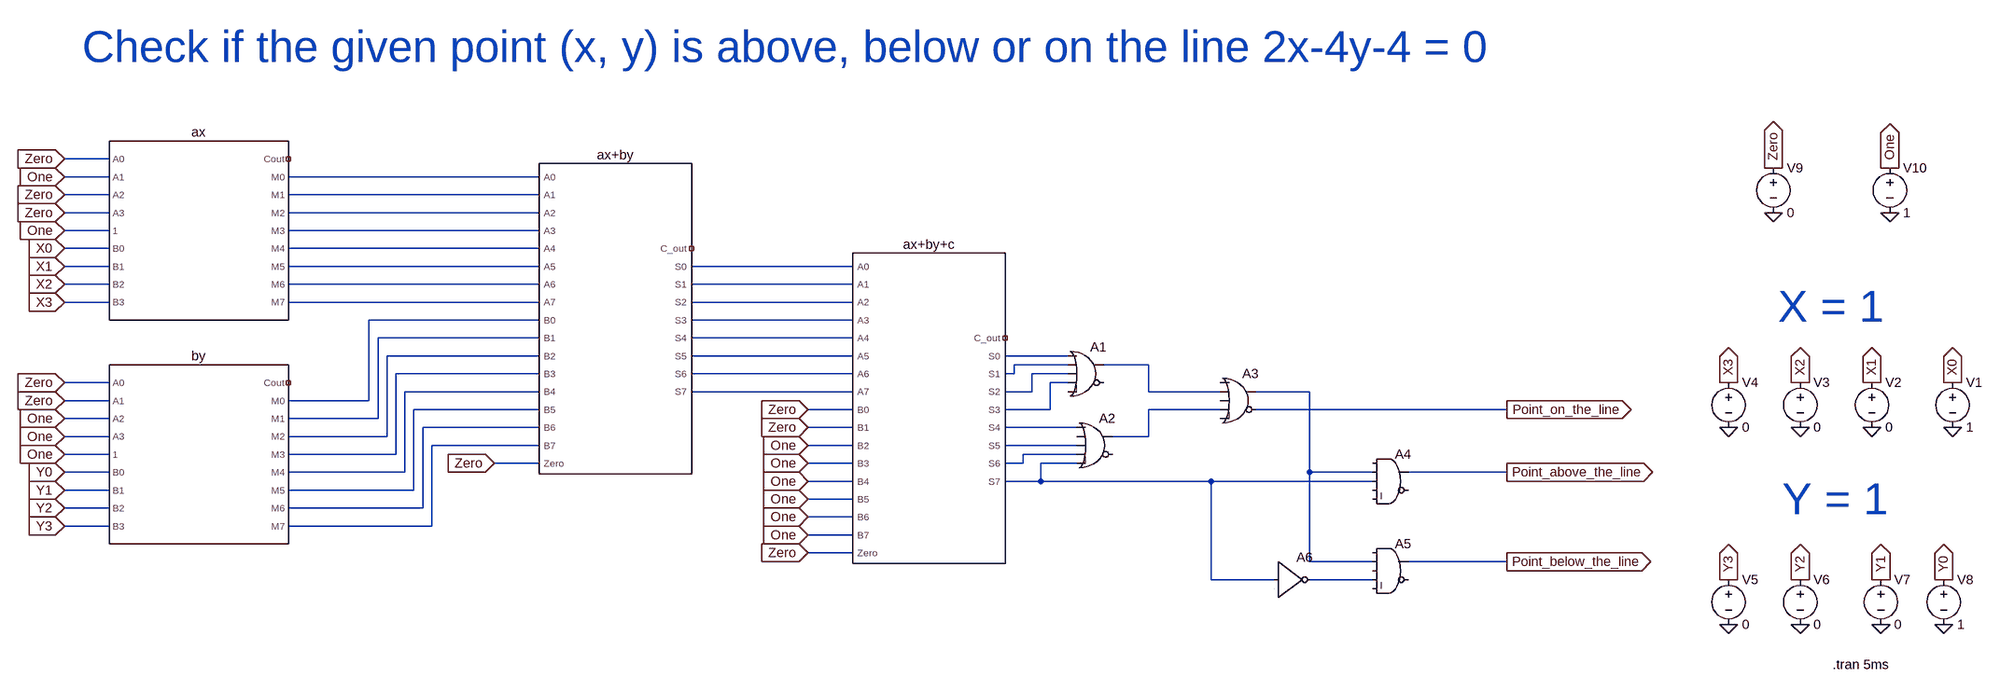
[diagram p0: schematic P3_above_the_line.asc]
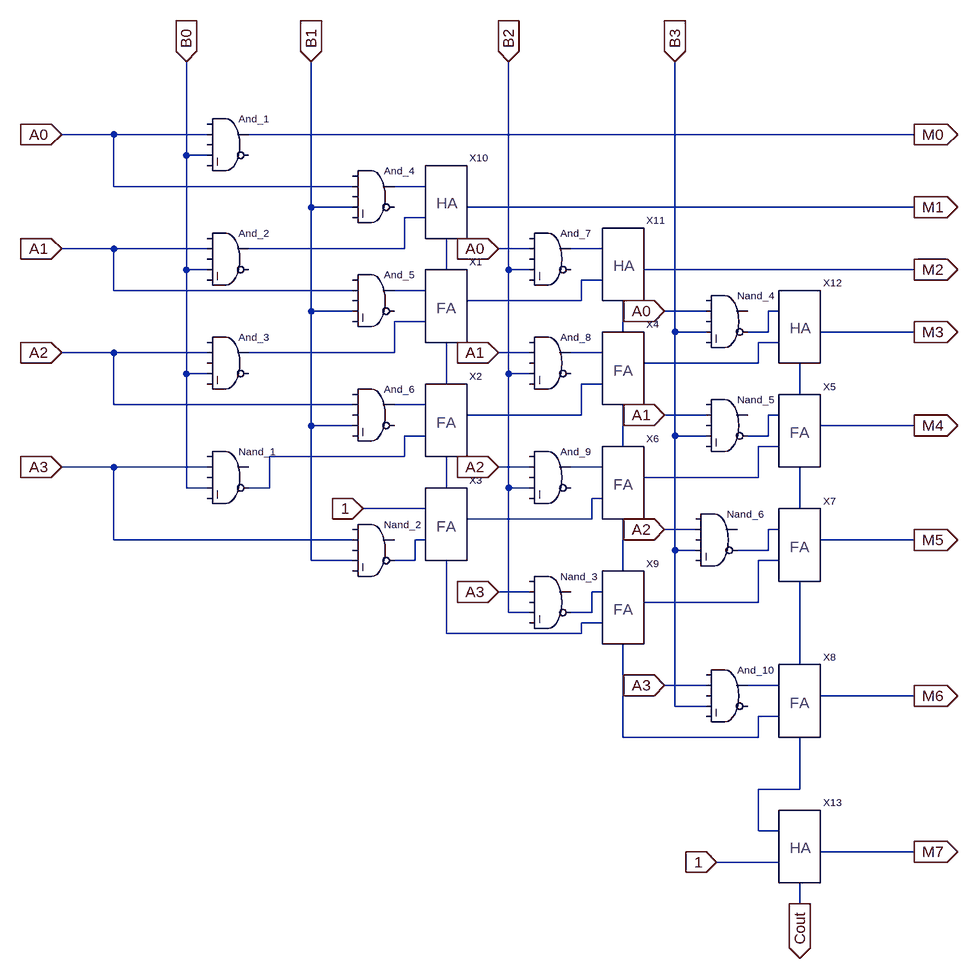
[diagram p1: sub-circuit bough_wooley_multiplier.asc]
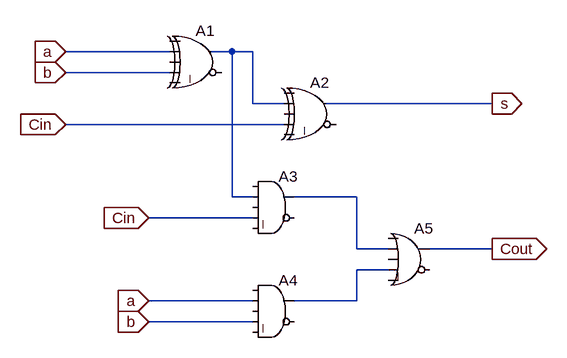
[diagram p2: sub-circuit full_adder_vertical.asc]
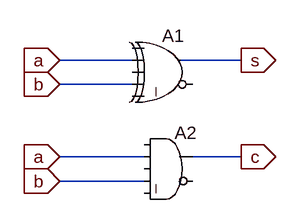
[diagram p3: sub-circuit half_adder.asc]
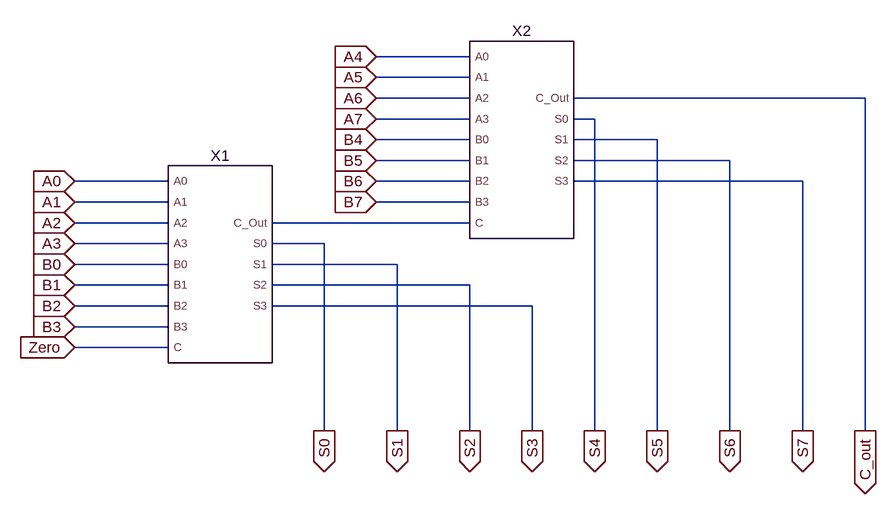
[diagram p4: sub-circuit 8-bit_adder.asc]
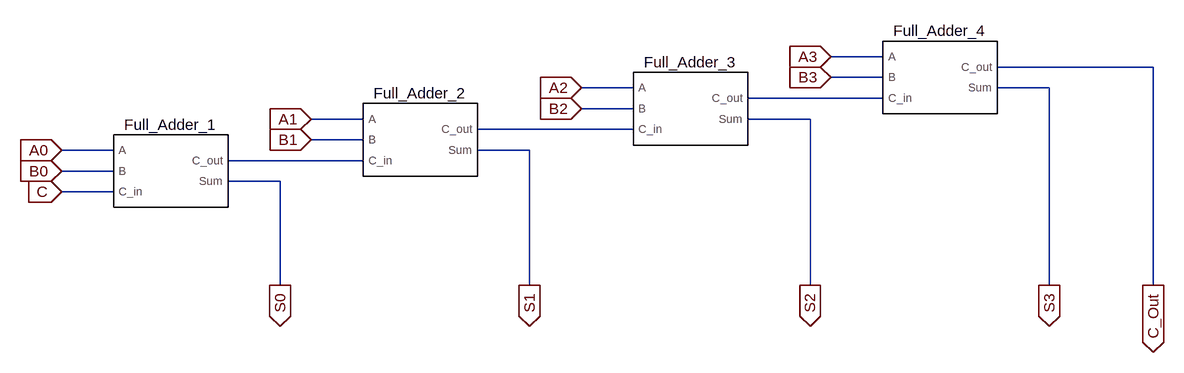
[diagram p5: sub-circuit 4-bit_adder.asc]
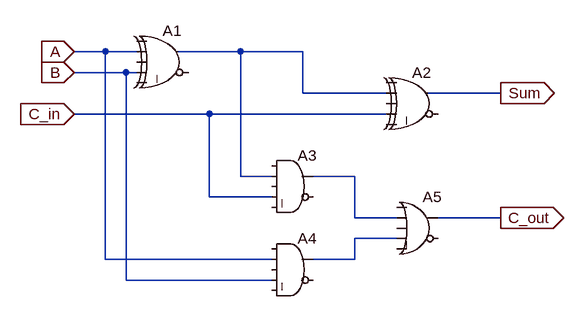
[diagram p6: sub-circuit full_adder.asc]
P3_above_the_line.asc, the LTspice schematic file:
Version 4
SHEET 1 4052 1228
WIRE 0 64 -80 64
WIRE 0 96 -80 96
WIRE 768 96 320 96
WIRE 0 128 -80 128
WIRE 768 128 320 128
WIRE 0 160 -80 160
WIRE 768 160 320 160
WIRE 0 192 -80 192
WIRE 768 192 320 192
WIRE 0 224 -80 224
WIRE 768 224 320 224
WIRE 0 256 -80 256
WIRE 768 256 320 256
WIRE 1328 256 1040 256
WIRE 0 288 -80 288
WIRE 768 288 320 288
WIRE 1328 288 1040 288
WIRE 0 320 -80 320
WIRE 768 320 320 320
WIRE 1328 320 1040 320
WIRE 768 352 464 352
WIRE 1328 352 1040 352
WIRE 768 384 480 384
WIRE 1328 384 1040 384
WIRE 768 416 496 416
WIRE 1328 416 1040 416
WIRE 1712 416 1600 416
WIRE 1712 432 1616 432
WIRE 1856 432 1776 432
WIRE 768 448 512 448
WIRE 1328 448 1040 448
WIRE 1616 448 1616 432
WIRE 1616 448 1600 448
WIRE 1712 448 1648 448
WIRE 0 464 -80 464
WIRE 1712 464 1680 464
WIRE 768 480 528 480
WIRE 1328 480 1040 480
WIRE 1648 480 1648 448
WIRE 1648 480 1600 480
WIRE 1856 480 1856 432
WIRE 1984 480 1856 480
WIRE 2144 480 2048 480
WIRE 0 496 -80 496
WIRE 464 496 464 352
WIRE 464 496 320 496
WIRE 768 512 544 512
WIRE 1328 512 1248 512
WIRE 1680 512 1680 464
WIRE 1680 512 1600 512
WIRE 1984 512 1856 512
WIRE 2496 512 2048 512
WIRE 0 528 -80 528
WIRE 480 528 480 384
WIRE 480 528 320 528
WIRE 768 544 560 544
WIRE 1328 544 1248 544
WIRE 1728 544 1600 544
WIRE 0 560 -80 560
WIRE 496 560 496 416
WIRE 496 560 320 560
WIRE 1856 560 1856 512
WIRE 1856 560 1792 560
WIRE 768 576 576 576
WIRE 1328 576 1248 576
WIRE 1728 576 1600 576
WIRE 0 592 -80 592
WIRE 512 592 512 448
WIRE 512 592 320 592
WIRE 1728 592 1632 592
WIRE 768 608 688 608
WIRE 1328 608 1248 608
WIRE 1632 608 1632 592
WIRE 1632 608 1600 608
WIRE 1728 608 1664 608
WIRE 0 624 -80 624
WIRE 528 624 528 480
WIRE 528 624 320 624
WIRE 2144 624 2144 480
WIRE 2256 624 2144 624
WIRE 2496 624 2320 624
WIRE 1328 640 1248 640
WIRE 1664 640 1664 608
WIRE 1664 640 1600 640
WIRE 1968 640 1664 640
WIRE 2256 640 1968 640
WIRE 0 656 -80 656
WIRE 544 656 544 512
WIRE 544 656 320 656
WIRE 1328 672 1248 672
WIRE 0 688 -80 688
WIRE 560 688 560 544
WIRE 560 688 320 688
WIRE 1328 704 1248 704
WIRE 0 720 -80 720
WIRE 576 720 576 576
WIRE 576 720 320 720
WIRE 1328 736 1248 736
WIRE 1328 768 1248 768
WIRE 2144 784 2144 624
WIRE 2256 784 2144 784
WIRE 2496 784 2320 784
WIRE 1968 816 1968 640
WIRE 2080 816 1968 816
WIRE 2256 816 2144 816
FLAG -80 96 One
IOPIN -80 96 In
FLAG -80 128 Zero
IOPIN -80 128 In
FLAG -80 160 Zero
IOPIN -80 160 In
FLAG -80 64 Zero
IOPIN -80 64 In
FLAG -80 192 One
IOPIN -80 192 In
FLAG -80 224 X0
IOPIN -80 224 In
FLAG -80 256 X1
IOPIN -80 256 In
FLAG -80 288 X2
IOPIN -80 288 In
FLAG -80 320 X3
IOPIN -80 320 In
FLAG -80 496 Zero
IOPIN -80 496 In
FLAG -80 528 One
IOPIN -80 528 In
FLAG -80 560 One
IOPIN -80 560 In
FLAG -80 464 Zero
IOPIN -80 464 In
FLAG -80 592 One
IOPIN -80 592 In
FLAG -80 624 Y0
IOPIN -80 624 In
FLAG -80 656 Y1
IOPIN -80 656 In
FLAG -80 688 Y2
IOPIN -80 688 In
FLAG -80 720 Y3
IOPIN -80 720 In
FLAG 688 608 Zero
IOPIN 688 608 In
FLAG 1248 512 Zero
IOPIN 1248 512 In
FLAG 1248 544 Zero
IOPIN 1248 544 In
FLAG 1248 576 One
IOPIN 1248 576 In
FLAG 1248 608 One
IOPIN 1248 608 In
FLAG 1248 640 One
IOPIN 1248 640 In
FLAG 1248 672 One
IOPIN 1248 672 In
FLAG 1248 704 One
IOPIN 1248 704 In
FLAG 1248 736 One
IOPIN 1248 736 In
FLAG 1248 768 Zero
IOPIN 1248 768 In
FLAG 2496 512 Point_on_the_line
IOPIN 2496 512 Out
FLAG 2496 624 Point_above_the_line
IOPIN 2496 624 Out
FLAG 2496 784 Point_below_the_line
IOPIN 2496 784 Out
FLAG 3552 544 0
FLAG 3408 544 0
FLAG 3280 544 0
FLAG 3152 544 0
FLAG 3152 896 0
FLAG 3280 896 0
FLAG 3424 896 0
FLAG 3536 896 0
FLAG 3552 464 X0
IOPIN 3552 464 Out
FLAG 3408 464 X1
IOPIN 3408 464 Out
FLAG 3280 464 X2
IOPIN 3280 464 Out
FLAG 3152 464 X3
IOPIN 3152 464 Out
FLAG 3152 816 Y3
IOPIN 3152 816 Out
FLAG 3280 816 Y2
IOPIN 3280 816 Out
FLAG 3424 816 Y1
IOPIN 3424 816 Out
FLAG 3536 816 Y0
IOPIN 3536 816 Out
FLAG 3232 160 0
FLAG 3440 160 0
FLAG 3232 80 Zero
IOPIN 3232 80 Out
FLAG 3440 80 One
IOPIN 3440 80 Out
SYMBOL Digital\\or 1744 384 R0
SYMATTR InstName A1
SYMBOL Digital\\or 1760 512 R0
SYMATTR InstName A2
SYMBOL Digital\\or 2016 432 R0
SYMATTR InstName A3
SYMBOL Digital\\and 2288 576 R0
SYMATTR InstName A4
SYMBOL Digital\\and 2288 736 R0
SYMATTR InstName A5
SYMBOL Digital\\inv 2080 752 R0
SYMATTR InstName A6
SYMBOL voltage 3552 448 R0
WINDOW 123 0 0 Left 0
WINDOW 39 0 0 Left 0
SYMATTR InstName V1
SYMATTR Value 1
SYMBOL voltage 3408 448 R0
WINDOW 123 0 0 Left 0
WINDOW 39 0 0 Left 0
SYMATTR InstName V2
SYMATTR Value 0
SYMBOL voltage 3280 448 R0
WINDOW 123 0 0 Left 0
WINDOW 39 0 0 Left 0
SYMATTR InstName V3
SYMATTR Value 0
SYMBOL voltage 3152 448 R0
WINDOW 123 0 0 Left 0
WINDOW 39 0 0 Left 0
SYMATTR InstName V4
SYMATTR Value 0
SYMBOL voltage 3152 800 R0
WINDOW 123 0 0 Left 0
WINDOW 39 0 0 Left 0
SYMATTR InstName V5
SYMATTR Value 0
SYMBOL voltage 3280 800 R0
WINDOW 123 0 0 Left 0
WINDOW 39 0 0 Left 0
SYMATTR InstName V6
SYMATTR Value 0
SYMBOL voltage 3424 800 R0
WINDOW 123 0 0 Left 0
WINDOW 39 0 0 Left 0
SYMATTR InstName V7
SYMATTR Value 0
SYMBOL voltage 3536 800 R0
WINDOW 123 0 0 Left 0
WINDOW 39 0 0 Left 0
SYMATTR InstName V8
SYMATTR Value 1
SYMBOL voltage 3232 64 R0
WINDOW 123 0 0 Left 0
WINDOW 39 0 0 Left 0
SYMATTR InstName V9
SYMATTR Value 0
SYMBOL voltage 3440 64 R0
WINDOW 123 0 0 Left 0
WINDOW 39 0 0 Left 0
SYMATTR InstName V10
SYMATTR Value 1
SYMBOL Bough_Wooley_Multiplier 128 144 R0
SYMATTR InstName ax
SYMBOL Bough_Wooley_Multiplier 128 544 R0
SYMATTR InstName by
SYMBOL 8-bit_Adder 832 352 R0
SYMATTR InstName ax+by
SYMBOL 8-bit_Adder 1392 512 R0
SYMATTR InstName ax+by+c
TEXT -48 -136 Left 6 ;Check if the given point (x, y) is above, below or on the line 2x-4y-4 = 0
TEXT 3240 328 Left 6 ;X = 1
TEXT 3248 672 Left 6 ;Y = 1
TEXT 3338 968 Left 2 !.tran 5ms

bough_wooley_multiplier.asc, the sub-circuit schematic file:
Version 4
SHEET 1 3160 1104
WIRE 544 -336 464 -336
WIRE 688 -336 544 -336
WIRE 1776 -336 752 -336
WIRE 656 -304 656 -448
WIRE 688 -304 656 -304
WIRE 544 -256 544 -336
WIRE 912 -256 544 -256
WIRE 1024 -256 976 -256
WIRE 848 -224 848 -448
WIRE 912 -224 848 -224
WIRE 1776 -224 1088 -224
WIRE 1024 -208 992 -208
WIRE 544 -160 464 -160
WIRE 688 -160 544 -160
WIRE 992 -160 992 -208
WIRE 992 -160 752 -160
WIRE 1184 -160 1136 -160
WIRE 1296 -160 1248 -160
WIRE 656 -128 656 -304
WIRE 688 -128 656 -128
WIRE 1056 -128 1056 -176
WIRE 1152 -128 1152 -448
WIRE 1184 -128 1152 -128
WIRE 1776 -128 1360 -128
WIRE 1296 -112 1264 -112
WIRE 544 -96 544 -160
WIRE 912 -96 544 -96
WIRE 1024 -96 976 -96
WIRE 1264 -80 1264 -112
WIRE 1264 -80 1088 -80
WIRE 848 -64 848 -224
WIRE 912 -64 848 -64
WIRE 1456 -64 1392 -64
WIRE 1568 -64 1552 -64
WIRE 1024 -48 976 -48
WIRE 1328 -32 1328 -80
WIRE 1408 -32 1408 -448
WIRE 1456 -32 1408 -32
WIRE 1552 -32 1552 -64
WIRE 1552 -32 1520 -32
WIRE 1776 -32 1632 -32
WIRE 1568 -16 1536 -16
WIRE 544 0 464 0
WIRE 688 0 544 0
WIRE 976 0 976 -48
WIRE 976 0 752 0
WIRE 1184 0 1136 0
WIRE 1296 0 1248 0
WIRE 1536 16 1536 -16
WIRE 1536 16 1360 16
WIRE 656 32 656 -128
WIRE 688 32 656 32
WIRE 1152 32 1152 -128
WIRE 1184 32 1152 32
WIRE 1056 48 1056 -16
WIRE 1296 48 1264 48
WIRE 1600 64 1600 16
WIRE 544 80 544 0
WIRE 912 80 544 80
WIRE 1024 80 976 80
WIRE 1264 96 1264 48
WIRE 1264 96 1088 96
WIRE 1456 96 1392 96
WIRE 1568 96 1552 96
WIRE 848 112 848 -64
WIRE 912 112 848 112
WIRE 1776 112 1632 112
WIRE 1024 128 992 128
WIRE 1408 128 1408 -32
WIRE 1456 128 1408 128
WIRE 1552 128 1552 96
WIRE 1552 128 1520 128
WIRE 1328 144 1328 80
WIRE 1568 144 1536 144
WIRE 992 160 992 128
WIRE 992 160 784 160
WIRE 544 176 464 176
WIRE 688 176 544 176
WIRE 1184 176 1136 176
WIRE 1296 176 1248 176
WIRE 1536 192 1536 144
WIRE 1536 192 1360 192
WIRE 656 208 656 32
WIRE 688 208 656 208
WIRE 784 208 784 160
WIRE 784 208 752 208
WIRE 1056 208 1056 160
WIRE 1152 208 1152 32
WIRE 1184 208 1152 208
WIRE 1296 224 1280 224
WIRE 1024 240 928 240
WIRE 1600 240 1600 176
WIRE 1280 256 1280 224
WIRE 1280 256 1088 256
WIRE 1440 272 1392 272
WIRE 1568 272 1552 272
WIRE 544 288 544 176
WIRE 912 288 544 288
WIRE 1024 288 1008 288
WIRE 1776 288 1632 288
WIRE 1408 304 1408 128
WIRE 1440 304 1408 304
WIRE 1552 304 1552 272
WIRE 1552 304 1504 304
WIRE 848 320 848 112
WIRE 912 320 848 320
WIRE 1008 320 1008 288
WIRE 1008 320 976 320
WIRE 1568 320 1536 320
WIRE 1328 336 1328 256
WIRE 1184 368 1136 368
WIRE 1296 368 1280 368
WIRE 1536 384 1536 320
WIRE 1536 384 1360 384
WIRE 1152 400 1152 208
WIRE 1184 400 1152 400
WIRE 1280 400 1280 368
WIRE 1280 400 1248 400
WIRE 1296 416 1264 416
WIRE 1056 432 1056 320
WIRE 1264 432 1264 416
WIRE 1264 432 1056 432
WIRE 1600 480 1600 352
WIRE 1456 512 1392 512
WIRE 1568 512 1520 512
WIRE 1776 528 1632 528
WIRE 1408 544 1408 304
WIRE 1456 544 1408 544
WIRE 1568 560 1536 560
WIRE 1328 592 1328 448
WIRE 1536 592 1536 560
WIRE 1536 592 1328 592
WIRE 1600 672 1600 592
WIRE 1600 672 1536 672
WIRE 1536 736 1536 672
WIRE 1568 736 1536 736
WIRE 1776 768 1632 768
WIRE 1568 784 1472 784
WIRE 1600 848 1600 816
FLAG 464 -336 A0
IOPIN 464 -336 In
FLAG 464 -160 A1
IOPIN 464 -160 In
FLAG 464 0 A2
IOPIN 464 0 In
FLAG 464 176 A3
IOPIN 464 176 In
FLAG 1136 -160 A0
IOPIN 1136 -160 In
FLAG 1136 0 A1
IOPIN 1136 0 In
FLAG 1136 176 A2
IOPIN 1136 176 In
FLAG 1136 368 A3
IOPIN 1136 368 In
FLAG 1392 -64 A0
IOPIN 1392 -64 In
FLAG 1392 96 A1
IOPIN 1392 96 In
FLAG 1392 272 A2
IOPIN 1392 272 In
FLAG 1392 512 A3
IOPIN 1392 512 In
FLAG 1408 -448 B3
IOPIN 1408 -448 In
FLAG 1152 -448 B2
IOPIN 1152 -448 In
FLAG 848 -448 B1
IOPIN 848 -448 In
FLAG 656 -448 B0
IOPIN 656 -448 In
FLAG 1776 -336 M0
IOPIN 1776 -336 Out
FLAG 1776 -224 M1
IOPIN 1776 -224 Out
FLAG 1776 -128 M2
IOPIN 1776 -128 Out
FLAG 1776 -32 M3
IOPIN 1776 -32 Out
FLAG 1776 112 M4
IOPIN 1776 112 Out
FLAG 1776 288 M5
IOPIN 1776 288 Out
FLAG 1776 528 M6
IOPIN 1776 528 Out
FLAG 1776 768 M7
IOPIN 1776 768 Out
FLAG 928 240 1
IOPIN 928 240 In
FLAG 1472 784 1
IOPIN 1472 784 In
FLAG 1600 848 Cout
IOPIN 1600 848 Out
SYMBOL Digital\\and 720 -384 R0
WINDOW 0 16 24 Left 1
SYMATTR InstName And_1
SYMBOL Digital\\and 720 -208 R0
WINDOW 0 16 24 Left 1
SYMATTR InstName And_2
SYMBOL Digital\\and 720 -48 R0
WINDOW 0 16 24 Left 1
SYMATTR InstName And_3
SYMBOL Digital\\and 720 128 R0
WINDOW 0 16 24 Left 1
SYMATTR InstName Nand_1
SYMBOL Digital\\and 944 -304 R0
WINDOW 0 16 24 Left 1
SYMATTR InstName And_4
SYMBOL Digital\\and 944 -144 R0
WINDOW 0 16 24 Left 1
SYMATTR InstName And_5
SYMBOL Digital\\and 944 32 R0
WINDOW 0 16 24 Left 1
SYMATTR InstName And_6
SYMBOL Digital\\and 944 240 R0
WINDOW 0 16 24 Left 1
SYMATTR InstName Nand_2
SYMBOL Digital\\and 1216 -208 R0
WINDOW 0 16 24 Left 1
SYMATTR InstName And_7
SYMBOL Digital\\and 1216 -48 R0
WINDOW 0 16 24 Left 1
SYMATTR InstName And_8
SYMBOL Digital\\and 1216 128 R0
WINDOW 0 16 24 Left 1
SYMATTR InstName And_9
SYMBOL Digital\\and 1216 320 R0
WINDOW 0 16 24 Left 1
SYMATTR InstName Nand_3
SYMBOL Digital\\and 1488 -112 R0
WINDOW 0 16 24 Left 1
SYMATTR InstName Nand_4
SYMBOL Digital\\and 1488 48 R0
WINDOW 0 16 24 Left 1
SYMATTR InstName Nand_5
SYMBOL Digital\\and 1472 224 R0
WINDOW 0 16 24 Left 1
SYMATTR InstName Nand_6
SYMBOL Digital\\and 1488 464 R0
WINDOW 0 16 24 Left 1
SYMATTR InstName And_10
SYMBOL Full_Adder_Vertical 1088 -80 R0
SYMATTR InstName X1
SYMBOL Full_Adder_Vertical 1088 96 R0
SYMATTR InstName X2
SYMBOL Full_Adder_Vertical 1088 256 R0
SYMATTR InstName X3
SYMBOL Full_Adder_Vertical 1360 16 R0
SYMATTR InstName X4
SYMBOL Full_Adder_Vertical 1632 112 R0
SYMATTR InstName X5
SYMBOL Full_Adder_Vertical 1360 192 R0
SYMATTR InstName X6
SYMBOL Full_Adder_Vertical 1632 288 R0
SYMATTR InstName X7
SYMBOL Full_Adder_Vertical 1632 528 R0
SYMATTR InstName X8
SYMBOL Full_Adder_Vertical 1360 384 R0
SYMATTR InstName X9
SYMBOL Half_Adder 1072 -208 R0
SYMATTR InstName X10
SYMBOL Half_Adder 1344 -112 R0
SYMATTR InstName X11
SYMBOL Half_Adder 1616 -16 R0
SYMATTR InstName X12
SYMBOL Half_Adder 1616 784 R0
SYMATTR InstName X13

full_adder_vertical.asc, the sub-circuit schematic file:
Version 4
SHEET 1 880 680
WIRE 48 48 -112 48
WIRE 144 48 112 48
WIRE 176 48 144 48
WIRE 48 80 -112 80
WIRE 176 128 176 48
WIRE 224 128 176 128
WIRE 544 128 288 128
WIRE 224 160 -112 160
WIRE 144 272 144 48
WIRE 176 272 144 272
WIRE 336 272 240 272
WIRE 176 304 16 304
WIRE 336 352 336 272
WIRE 384 352 336 352
WIRE 544 352 448 352
WIRE 384 384 336 384
WIRE 176 432 16 432
WIRE 336 432 336 384
WIRE 336 432 240 432
WIRE 176 464 16 464
FLAG -112 48 a
IOPIN -112 48 In
FLAG -112 80 b
IOPIN -112 80 In
FLAG -112 160 Cin
IOPIN -112 160 In
FLAG 16 304 Cin
IOPIN 16 304 In
FLAG 16 432 a
IOPIN 16 432 In
FLAG 16 464 b
IOPIN 16 464 In
FLAG 544 128 s
IOPIN 544 128 Out
FLAG 544 352 Cout
IOPIN 544 352 Out
SYMBOL Digital\\xor 96 0 R0
SYMATTR InstName A1
SYMBOL Digital\\xor 272 80 R0
SYMATTR InstName A2
SYMBOL Digital\\and 208 224 R0
SYMATTR InstName A3
SYMBOL Digital\\and 208 384 R0
SYMATTR InstName A4
SYMBOL Digital\\or 416 304 R0
SYMATTR InstName A5

half_adder.asc, the sub-circuit schematic file:
Version 4
SHEET 1 880 680
WIRE 128 96 32 96
WIRE 272 96 192 96
WIRE 128 128 32 128
WIRE 144 224 32 224
WIRE 272 224 208 224
WIRE 144 256 32 256
FLAG 32 96 a
IOPIN 32 96 In
FLAG 32 128 b
IOPIN 32 128 In
FLAG 32 224 a
IOPIN 32 224 In
FLAG 32 256 b
IOPIN 32 256 In
FLAG 272 224 c
IOPIN 272 224 Out
FLAG 272 96 s
IOPIN 272 96 Out
SYMBOL Digital\\xor 176 48 R0
SYMATTR InstName A1
SYMBOL Digital\\and 176 176 R0
SYMATTR InstName A2

8-bit_adder.asc, the sub-circuit schematic file:
Version 4
SHEET 1 880 720
WIRE 128 16 -16 16
WIRE 128 48 -16 48
WIRE 128 80 -16 80
WIRE 736 80 288 80
WIRE 128 112 -16 112
WIRE 320 112 288 112
WIRE 128 144 -16 144
WIRE 416 144 288 144
WIRE 128 176 -16 176
WIRE 528 176 288 176
WIRE -336 208 -480 208
WIRE 128 208 -16 208
WIRE 640 208 288 208
WIRE -336 240 -480 240
WIRE 128 240 -16 240
WIRE -336 272 -480 272
WIRE 128 272 -176 272
WIRE -336 304 -480 304
WIRE -96 304 -176 304
WIRE -336 336 -480 336
WIRE 16 336 -176 336
WIRE -336 368 -480 368
WIRE 128 368 -176 368
WIRE -336 400 -480 400
WIRE 224 400 -176 400
WIRE -336 432 -480 432
WIRE -336 464 -480 464
WIRE -96 592 -96 304
WIRE 16 592 16 336
WIRE 128 592 128 368
WIRE 224 592 224 400
WIRE 320 592 320 112
WIRE 416 592 416 144
WIRE 528 592 528 176
WIRE 640 592 640 208
WIRE 736 592 736 80
FLAG -480 208 A0
IOPIN -480 208 In
FLAG -480 240 A1
IOPIN -480 240 In
FLAG -480 272 A2
IOPIN -480 272 In
FLAG -480 304 A3
IOPIN -480 304 In
FLAG -16 16 A4
IOPIN -16 16 In
FLAG -16 48 A5
IOPIN -16 48 In
FLAG -16 80 A6
IOPIN -16 80 In
FLAG -16 112 A7
IOPIN -16 112 In
FLAG -16 144 B4
IOPIN -16 144 In
FLAG -16 176 B5
IOPIN -16 176 In
FLAG -16 208 B6
IOPIN -16 208 In
FLAG -16 240 B7
IOPIN -16 240 In
FLAG -480 336 B0
IOPIN -480 336 In
FLAG -480 368 B1
IOPIN -480 368 In
FLAG -480 400 B2
IOPIN -480 400 In
FLAG -480 432 B3
IOPIN -480 432 In
FLAG -480 464 Zero
IOPIN -480 464 In
FLAG -96 592 S0
IOPIN -96 592 Out
FLAG 16 592 S1
IOPIN 16 592 Out
FLAG 128 592 S2
IOPIN 128 592 Out
FLAG 224 592 S3
IOPIN 224 592 Out
FLAG 320 592 S4
IOPIN 320 592 Out
FLAG 416 592 S5
IOPIN 416 592 Out
FLAG 528 592 S6
IOPIN 528 592 Out
FLAG 640 592 S7
IOPIN 640 592 Out
FLAG 736 592 C_out
IOPIN 736 592 Out
SYMBOL 4-bit_Adder 176 144 R0
SYMATTR InstName X2
SYMBOL 4-bit_Adder -288 336 R0
SYMATTR InstName X1

4-bit_adder.asc, the sub-circuit schematic file:
Version 4
SHEET 1 1200 1108
WIRE 672 160 592 160
WIRE 1088 176 848 176
WIRE 672 192 592 192
WIRE 288 208 208 208
WIRE 928 208 848 208
WIRE 672 224 464 224
WIRE 288 240 208 240
WIRE -128 256 -208 256
WIRE 560 256 464 256
WIRE 288 272 48 272
WIRE -128 288 -208 288
WIRE -512 304 -592 304
WIRE 128 304 48 304
WIRE -128 320 -336 320
WIRE -512 336 -592 336
WIRE -256 352 -336 352
WIRE -512 368 -592 368
WIRE -256 512 -256 352
WIRE 128 512 128 304
WIRE 560 512 560 256
WIRE 928 512 928 208
WIRE 1088 512 1088 176
FLAG -592 304 A0
IOPIN -592 304 In
FLAG -208 256 A1
IOPIN -208 256 In
FLAG 208 208 A2
IOPIN 208 208 In
FLAG 592 160 A3
IOPIN 592 160 In
FLAG 592 192 B3
IOPIN 592 192 In
FLAG 208 240 B2
IOPIN 208 240 In
FLAG -208 288 B1
IOPIN -208 288 In
FLAG -592 336 B0
IOPIN -592 336 In
FLAG 128 512 S1
IOPIN 128 512 Out
FLAG 560 512 S2
IOPIN 560 512 Out
FLAG 928 512 S3
IOPIN 928 512 Out
FLAG -256 512 S0
IOPIN -256 512 Out
FLAG 1088 512 C_Out
IOPIN 1088 512 Out
FLAG -592 368 C
IOPIN -592 368 In
SYMBOL Full_Adder -432 336 R0
SYMATTR InstName Full_Adder_1
SYMBOL Full_Adder -48 288 R0
SYMATTR InstName Full_Adder_2
SYMBOL Full_Adder 368 240 R0
SYMATTR InstName Full_Adder_3
SYMBOL Full_Adder 752 192 R0
SYMATTR InstName Full_Adder_4

full_adder.asc, the sub-circuit schematic file:
Version 4
SHEET 1 880 708
WIRE -96 64 -144 64
WIRE -48 64 -96 64
WIRE 112 64 16 64
WIRE 208 64 112 64
WIRE -64 96 -144 96
WIRE -48 96 -64 96
WIRE 208 128 208 64
WIRE 336 128 208 128
WIRE 512 128 400 128
WIRE 64 160 -144 160
WIRE 336 160 64 160
WIRE 112 256 112 64
WIRE 160 256 112 256
WIRE 288 256 224 256
WIRE 64 288 64 160
WIRE 160 288 64 288
WIRE 288 320 288 256
WIRE 352 320 288 320
WIRE 512 320 416 320
WIRE 352 352 288 352
WIRE -96 384 -96 64
WIRE 160 384 -96 384
WIRE 288 384 288 352
WIRE 288 384 224 384
WIRE -64 416 -64 96
WIRE 160 416 -64 416
FLAG -144 64 A
IOPIN -144 64 In
FLAG -144 96 B
IOPIN -144 96 In
FLAG -144 160 C_in
IOPIN -144 160 In
FLAG 512 128 Sum
IOPIN 512 128 Out
FLAG 512 320 C_out
IOPIN 512 320 Out
SYMBOL Digital\\xor 0 16 R0
SYMATTR InstName A1
SYMBOL Digital\\xor 384 80 R0
SYMATTR InstName A2
SYMBOL Digital\\and 192 208 R0
SYMATTR InstName A3
SYMBOL Digital\\and 192 336 R0
SYMATTR InstName A4
SYMBOL Digital\\or 384 272 R0
SYMATTR InstName A5

The netlist it stands for:
* P3_above_the_line.asc
A1 N018 N019 N023 N024 0 0 N020 0 OR
A2 N031 0 N033 N034 N035 0 N029 0 OR
A3 0 N020 0 N029 0 Point_on_the_line N027 0 OR
A4 0 N027 N035 0 0 0 Point_above_the_line 0 AND
A5 0 N027 0 N036 0 0 Point_below_the_line 0 AND
A6 N035 0 0 0 0 N036 0 0 BUF
V1 X0 0 1
V2 X1 0 0
V3 X2 0 0
V4 X3 0 0
V5 Y3 0 0
V6 Y2 0 0
V7 Y1 0 0
V8 Y0 0 1
V9 Zero 0 0
V10 One 0 1
Xax Zero One Zero Zero One X0 X1 X2 X3 NC_01 N001 N002 N003 N004 N005 N006 N008 N010 bough_wooley_multiplier
Xby Zero Zero One One One Y0 Y1 Y2 Y3 NC_02 N012 N014 N016 N021 N025 N028 N030 N032 bough_wooley_multiplier
Xax+by N001 N002 N003 N004 N005 N006 N008 N010 N012 N014 N016 N021 N025 N028 N030 N032 Zero NC_03 N007 N009 N011 N013 N015 N017 N022 N026 8-bit_adder
Xax+by+c N007 N009 N011 N013 N015 N017 N022 N026 Zero Zero One One One One One One Zero NC_04 N018 N019 N023 N024 N031 N033 N034 N035 8-bit_adder

* block symbol definitions
.subckt bough_wooley_multiplier A0 A1 A2 A3 1 B0 B1 B2 B3 Cout M0 M1 M2 M3 M4 M5 M6 M7
And_1 0 A0 0 B0 0 0 M0 0 AND
And_2 0 A1 0 B0 0 0 N002 0 AND
And_3 0 A2 0 B0 0 0 N008 0 AND
A§Nand_1 0 A3 0 B0 0 N017 0 0 AND
And_4 0 A0 0 B1 0 0 N001 0 AND
And_5 0 A1 0 B1 0 0 N006 0 AND
And_6 0 A2 0 B1 0 0 N015 0 AND
A§Nand_2 0 A3 0 B1 0 N025 0 0 AND
And_7 0 A0 0 B2 0 0 N003 0 AND
And_8 0 A1 0 B2 0 0 N011 0 AND
And_9 0 A2 0 B2 0 0 N020 0 AND
A§Nand_3 0 A3 0 B2 0 N028 0 0 AND
A§Nand_4 0 A0 0 B3 0 N007 0 0 AND
A§Nand_5 0 A1 0 B3 0 N016 0 0 AND
A§Nand_6 0 A2 0 B3 0 N024 0 0 AND
And_10 0 A3 0 B3 0 0 N031 0 AND
XX1 N008 N006 N004 N012 N005 full_adder_vertical
XX2 N017 N015 N012 N021 N013 full_adder_vertical
XX3 N025 1 N021 N029 N022 full_adder_vertical
XX4 N013 N011 N009 N018 N010 full_adder_vertical
XX5 N019 N016 N014 N023 M4 full_adder_vertical
XX6 N022 N020 N018 N027 N019 full_adder_vertical
XX7 N026 N024 N023 N030 M5 full_adder_vertical
XX8 N032 N031 N030 N033 M6 full_adder_vertical
XX9 N029 N028 N027 N032 N026 full_adder_vertical
XX10 N002 N001 N004 M1 half_adder
XX11 N005 N003 N009 M2 half_adder
XX12 N010 N007 N014 M3 half_adder
XX13 1 N033 Cout M7 half_adder
.ends bough_wooley_multiplier

.subckt full_adder_vertical a b Cin Cout s
A1 0 a 0 b 0 0 N001 0 XOR
A2 0 N001 0 Cin 0 0 s 0 XOR
A3 0 N001 0 Cin 0 0 N002 0 AND
A4 0 a 0 b 0 0 N003 0 AND
A5 0 N002 0 N003 0 0 Cout 0 OR
.ends full_adder_vertical

.subckt half_adder a b c s
A1 0 a 0 b 0 0 s 0 XOR
A2 0 a 0 b 0 0 c 0 AND
.ends half_adder

.subckt 8-bit_adder A0 A1 A2 A3 A4 A5 A6 A7 B0 B1 B2 B3 B4 B5 B6 B7 Zero C_out S0 S1 S2 S3 S4 S5 S6 S7
XX2 A4 A5 A6 A7 B4 B5 B6 B7 N001 C_out S4 S5 S6 S7 4-bit_adder
XX1 A0 A1 A2 A3 B0 B1 B2 B3 Zero N001 S0 S1 S2 S3 4-bit_adder
.ends 8-bit_adder

.subckt 4-bit_adder A0 A1 A2 A3 B0 B1 B2 B3 C C_Out S0 S1 S2 S3
XFull_Adder_1 A0 B0 C N003 S0 full_adder
XFull_Adder_2 A1 B1 N003 N002 S1 full_adder
XFull_Adder_3 A2 B2 N002 N001 S2 full_adder
XFull_Adder_4 A3 B3 N001 C_Out S3 full_adder
.ends 4-bit_adder

.subckt full_adder A B C_in C_out Sum
A1 0 A 0 B 0 0 N001 0 XOR
A2 0 N001 0 C_in 0 0 Sum 0 XOR
A3 0 N001 0 C_in 0 0 N002 0 AND
A4 0 A 0 B 0 0 N003 0 AND
A5 0 N002 0 N003 0 0 C_out 0 OR
.ends full_adder

* Check if the given point (x, y) is above, below or on the line 2x-4y-4 = 0
* X = 1
* Y = 1
.tran 5ms
.backanno
.end